# EAGLE design MRCS-Nano-Grade-Xing-Breakout (EAGLE 7.7.0)
PCR Clinic board
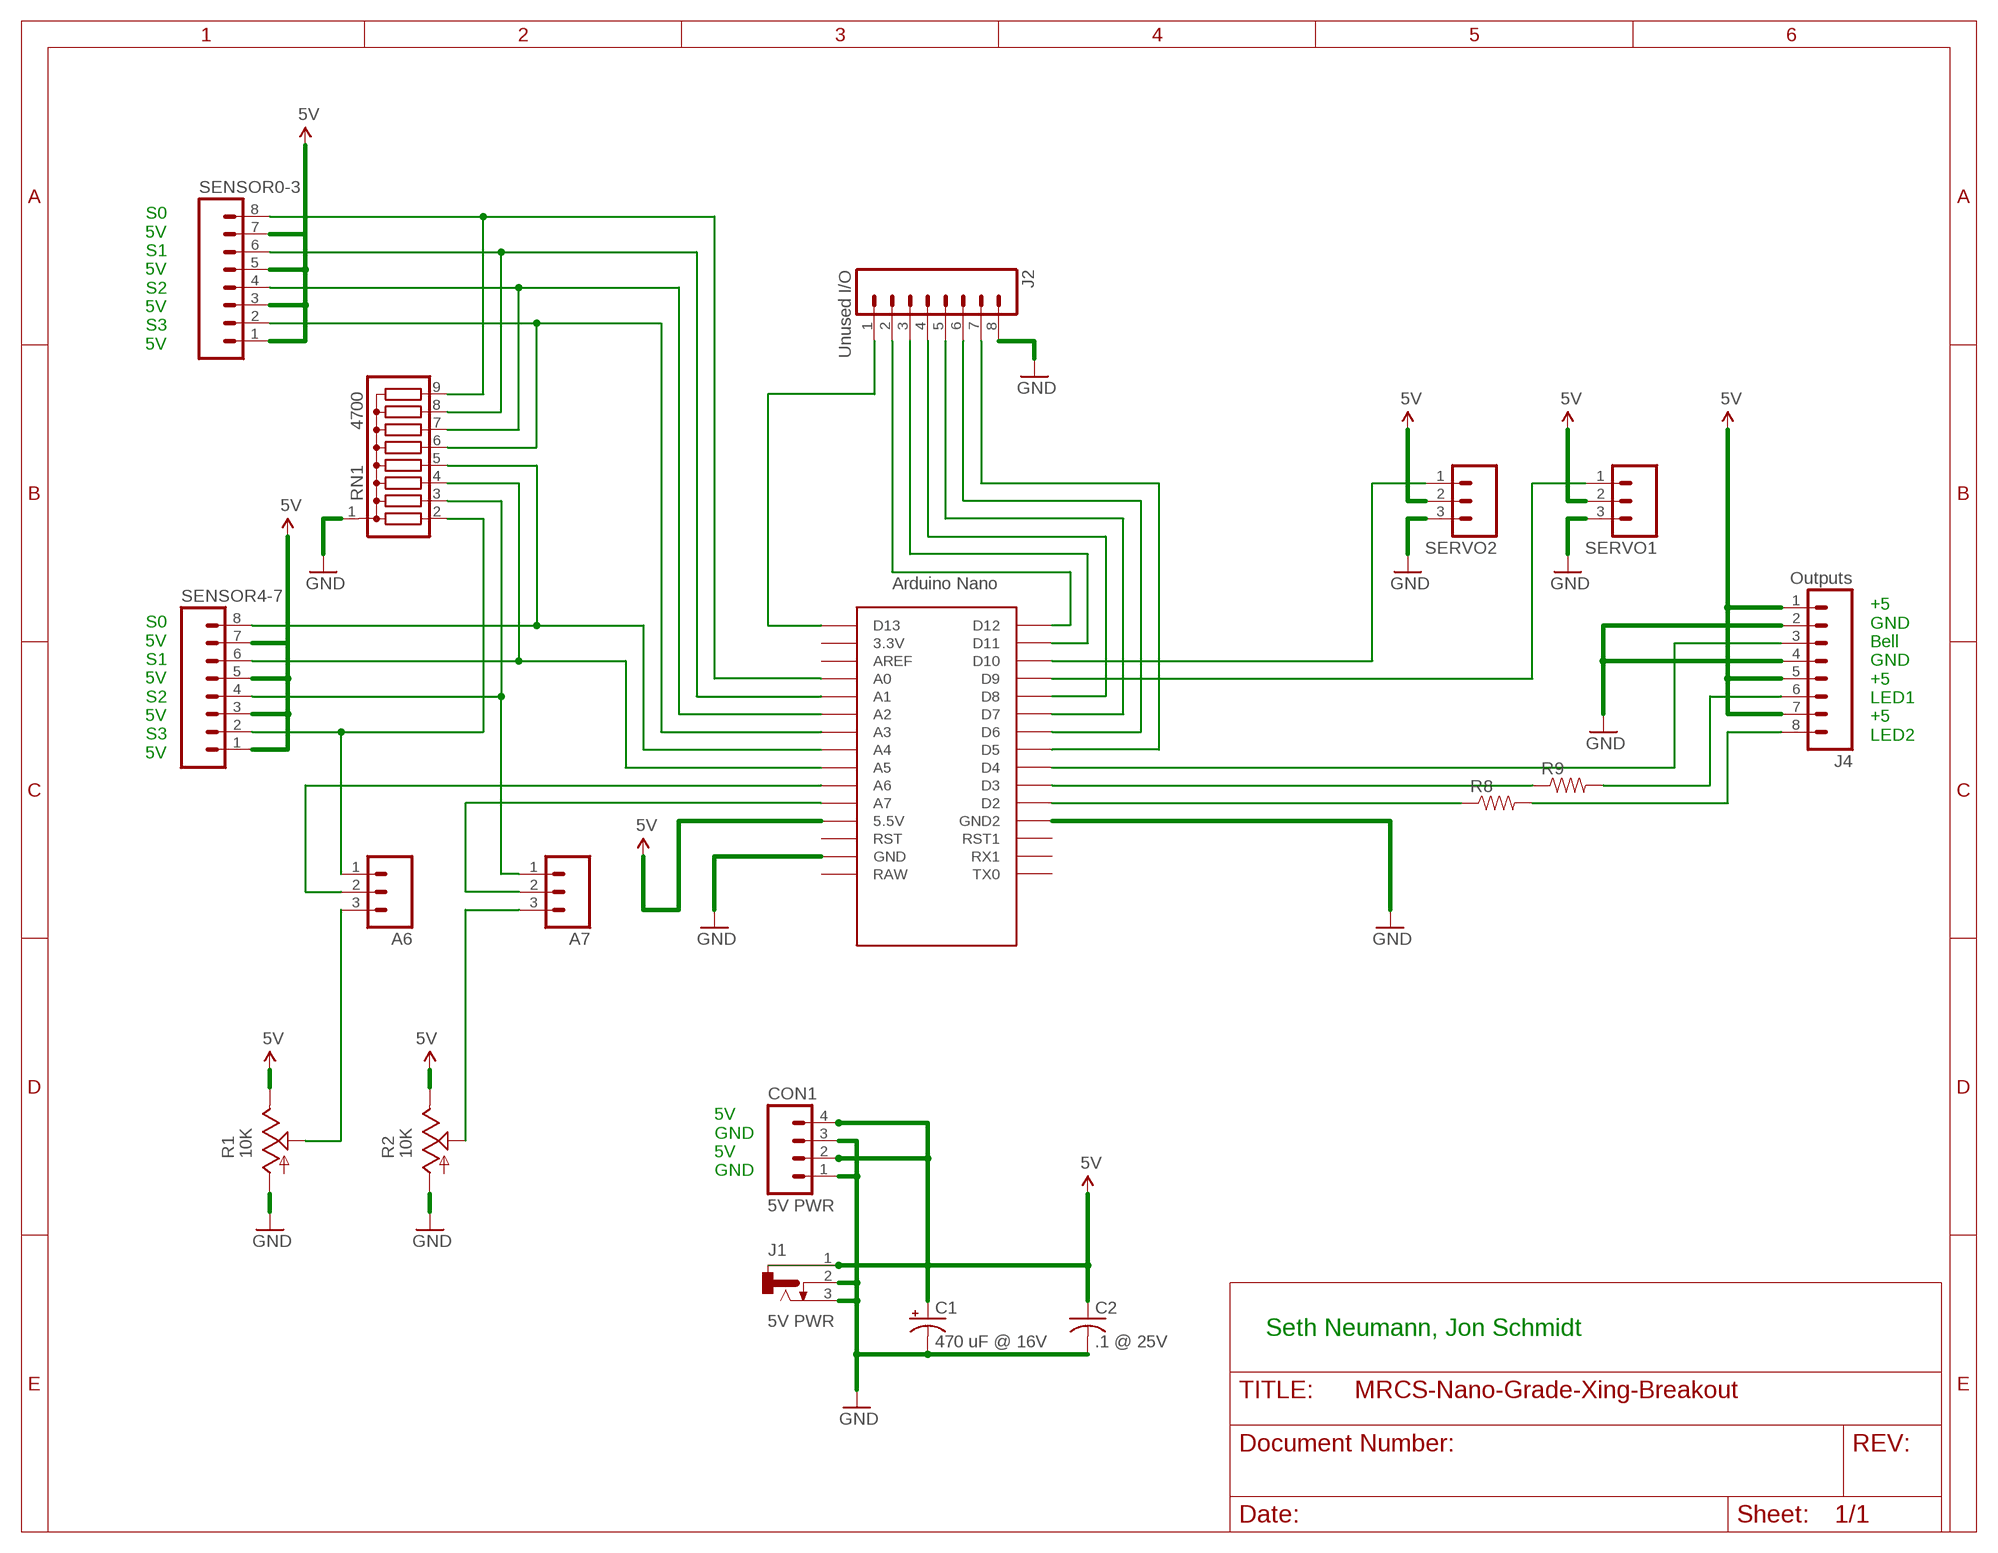
[diagram p0: schematic, sheet 1]

## Parts
A6  M03LOCK  [1X03_LOCK]
A7  M03LOCK  [1X03_LOCK]
C1  470 uF @ 16V  CAP-POLPTH-3.5MM  [E3.5-10]
C2  .1 @ 25V  CAPPTH2  [C-PTH-0.100]
CON1  5V PWR  CONNECTOR-M04SCREW_LOCK  [SCREWTERMINAL-3.5MM-4_LOCK]
J1  5V PWR  CONNECTOR-DC-POWER-RA  [DCJ0202]
J2  Unused I/O  CONNECTOR-M08LOCK  [1X08_LOCK]
J4  Outputs  CONNECTOR-M08LOCK  [1X08_LOCK]
R1  10K  TRIM_US-RS3  [RS3]
R2  10K  TRIM_US-RS3  [RS3]
R8  RPTH-R0  [CUT-R]
R9  RPTH-R0  [CUT-R]
RN1  4700  G08R  [SIL9]
SENSOR0-3  CONNECTOR-M08LOCK  [1X08_LOCK]
SENSOR4-7  CONNECTOR-M08LOCK  [1X08_LOCK]
SERVO1  M03LOCK  [1X03_LOCK]
SERVO2  M03LOCK  [1X03_LOCK]
U$1  NANO  [NANO]

## Nets
5V [Power]: C1.+ C2.1 CON1.2 CON1.4 J1.1 J4.1 J4.5 J4.7 R1.E R2.E SENSOR0-3.1 SENSOR0-3.3 SENSOR0-3.5 SENSOR0-3.7 SENSOR4-7.1 SENSOR4-7.3 SENSOR4-7.5 SENSOR4-7.7 SERVO1.2 SERVO2.2 U$1.5V(5.5V)
A0: RN1.9 SENSOR0-3.8 U$1.A0
GND [Power]: C1.- C2.2 CON1.1 CON1.3 J1.2 J1.3 J2.8 J4.2 J4.4 R1.A R2.A RN1.1 SERVO1.3 SERVO2.3 U$1.GND U$1.GND1(GND2)
N$1: RN1.5 SENSOR4-7.8 U$1.A4
N$2: R8.P2 U$1.D2
N$3: J4.8 R8.P1
N$4: R9.P2 U$1.D3
N$5: J4.6 R9.P1
N$6: J4.3 U$1.D4
N$7: RN1.4 SENSOR4-7.6 U$1.A5
N$8: SERVO2.1 U$1.D10
N$9: SERVO1.1 U$1.D9
N$10: RN1.7 SENSOR0-3.4 U$1.A2
N$11: A7.1 RN1.3 SENSOR4-7.4
N$12: RN1.6 SENSOR0-3.2 U$1.A3
N$13: A6.1 RN1.2 SENSOR4-7.2
N$14: A6.3 R1.S
N$15: A6.2 U$1.A6
N$16: A7.2 U$1.A7
N$17: RN1.8 SENSOR0-3.6 U$1.A1
N$18: A7.3 R2.S
N$19: J2.1 U$1.D13
N$20: J2.2 U$1.D12
N$21: J2.3 U$1.D11
N$22: J2.4 U$1.D8
N$23: J2.5 U$1.D7
N$24: J2.6 U$1.D6
N$25: J2.7 U$1.D5
Unconnected: U$1.3.3V U$1.AREF U$1.RAW U$1.RST U$1.RST1 U$1.RX1 U$1.TX0

## Notes on the sheet
- S0
  5V
  S1
  5V
  S2
  5V
  S3
  5V
- +5
  GND
  Bell
  GND
  +5
  LED1
  +5
  LED2
- S0
  5V
  S1
  5V
  S2
  5V
  S3
  5V
- 5V
  GND
  5V
  GND
- Seth Neumann, Jon Schmidt

## Library data of the parts
A6 A7 SERVO1 SERVO2 = SparkFun-Connectors:M03: Header 3 Standard 3-pin 0.1" header. Use with straight break away headers (SKU : PRT-00116), right angle break away headers (PRT-00553), swiss pins (PRT-00743), machine pins (PRT-00117), and female headers (PRT-00115). Molex polarized connector foot print use with SKU : PRT-08232 with associated crimp pins and housings.
C1 = SPCoast:CAP-POL*
C2 = SPCoast:CAP*
CON1 = SPCoast:CONNECTOR-M04: Header 4 Standard 4-pin 0.1" header. Use with straight break away headers (SKU : PRT-00116), right angle break away headers (PRT-00553), swiss pins (PRT-00743), machine pins (PRT-00117), and female headers (PRT-00115). Molex polarized connector foot print use with SKU : PRT-08231 with associated crimp pins and housings. 1MM SMD Version SKU: PRT-10208
J1 = SPCoast:CONNECTOR-DC-POWER: DC POWER JACK Source: DCJ0202.pdf
J2 J4 SENSOR0-3 SENSOR4-7 = SPCoast:CONNECTOR-M08: Header 8 Standard 8-pin 0.1" header. Use with straight break away headers (SKU : PRT-00116), right angle break away headers (PRT-00553), swiss pins (PRT-00743), machine pins (PRT-00117), and female headers (PRT-00115).
R1 R2 = pot:TRIM_US-: POTENTIOMETER
R8 R9 = SPCoast:R*: Resistor Basic schematic elements and footprints for 0603, 1206, and PTH 1/10th watt (small) resistors.
RN1 = resistor-sil:G08R: SIL RESISTOR; OC_FARNELL: unknown; OC_NEWARK: unknown
U$1 = Arduino-clone-scn:NANO: Arduino Nano

## Net classes
0 default: width 0.305 mm
1 Power: width 0.61 mm

## Board
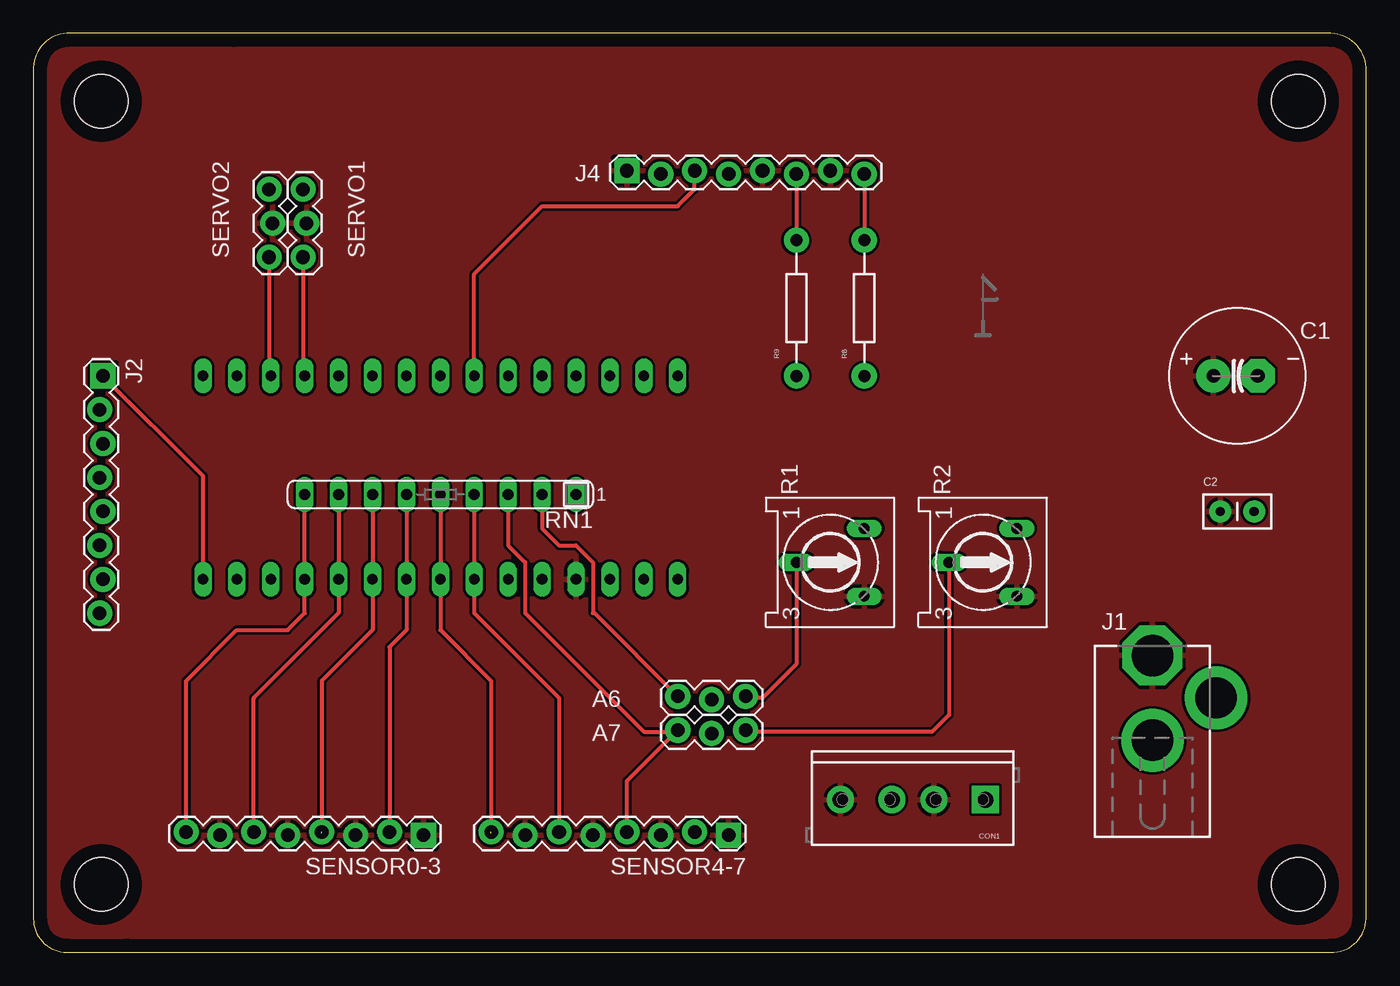
[diagram p1: board, top side]
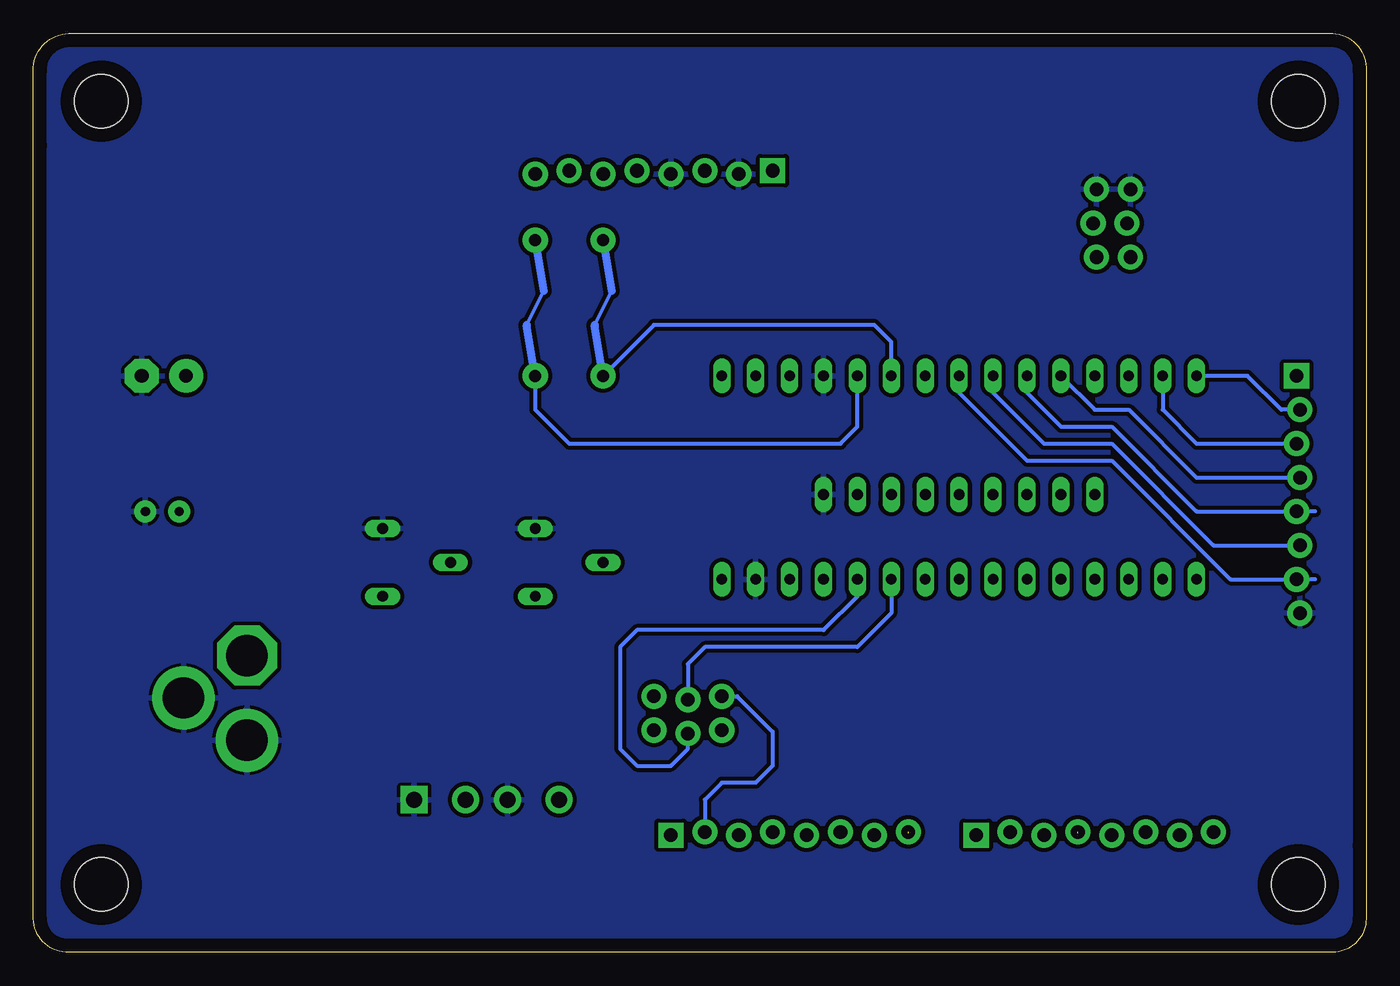
[diagram p2: board, bottom side, seen from below]

Size 99.82 x 68.83 mm. Coordinates in mm from the lower left corner, seen from the top.
Copper layers (1*16): Top 0.035mm / dielectric 1.5mm / Bottom 0.035mm
Design rules "default": minimum track width 10mil, minimum drill 24mil, track to track 8mil, track to pad 8mil, pad to pad 8mil, via to via 8mil, smd to smd 8mil, copper to edge 40mil, drill to drill 8mil, minimum pad ring 10mil, minimum via ring 8mil, stop-mask expansion 4mil, vias tented up to drill 0mil, thermal gap 10mil

### Footprints (pad centres in the part's own frame; a part is rotated, then mirrored left to right if it is on the bottom)
1X03_LOCK = drill 1.016 pad 1.88: 1 0,0.127; 2 2.54,-0.127; 3 5.08,0.127
E3.5-10 = drill 1.016 pad 2.54: + -1.79,0 | drill 1.016 pad 2.54 octagon: - 1.54,0
C-PTH-0.100 = drill 0.7 pad 1.651: 1 -1.27,0; 2 1.27,0
SCREWTERMINAL-3.5MM-4_LOCK = drill 1.2 pad 2.032 square: 1 -0.178,0 | drill 1.2 pad 2.032: 2 3.678,0; 3 6.822,0; 4 10.678,0
DCJ0202 = drill 3.1 pad 4.5 octagon: 1 0,3.175 | drill 3.1 pad 4.7: 2 4.763,0; 3 0,-3.175
1X08_LOCK = drill 1.016 pad 1.88 square: 1 0,0.127 | drill 1.016 pad 1.88: 2 2.54,-0.127; 3 5.08,0.127; 4 7.62,-0.127; 5 10.16,0.127; 6 12.7,-0.127; 7 15.24,0.127; 8 17.78,-0.127
RS3 = drill 0.813 long: A -2.54,2.54; E 2.54,2.54; S 0,-2.54
CUT-R = drill 0.9 pad 1.88: P1 5.08,0; P2 -5.08,0
SIL9 = drill 0.813 long: 1 -10.16,0; 2 -7.62,0; 3 -5.08,0; 4 -2.54,0; 5 0,0; 6 2.54,0; 7 5.08,0; 8 7.62,0; 9 10.16,0
NANO = drill 0.8 long: 3.3V -10.16,24.13; 5V -10.16,-1.27; A0 -10.16,19.05; A1 -10.16,16.51; A2 -10.16,13.97; A3 -10.16,11.43; A4 -10.16,8.89; A5 -10.16,6.35; A6 -10.16,3.81; A7 -10.16,1.27; AREF -10.16,21.59; D2 5.08,1.27; D3 5.08,3.81; D4 5.08,6.35; D5 5.08,8.89; D6 5.08,11.43; D7 5.08,13.97; D8 5.08,16.51; D9 5.08,19.05; D10 5.08,21.59; D11 5.08,24.13; D12 5.08,26.67; D13 -10.16,26.67; GND -10.16,-6.35; GND1 5.08,-1.27; RAW -10.16,-8.89; RST -10.16,-3.81; RST1 5.08,-3.81; RX1 5.08,-6.35; TX0 5.08,-8.89
BOARD-DINRAIL-2.7IN = hole 4: 94.742,5.08; 5.08,63.754; 94.742,63.754; 5.08,5.08

### Placement (x,y rotation side)
A6  48.26,19.05 0 top
A7  48.26,16.51 0 top
C1  90.17,43.18 0 top
C2  90.17,33.02 0 top
CON1  71.12,11.43 180 top
J1  83.82,19.05 0 top
J2  5.08,43.18 270 top
J4  44.45,58.42 0 top
R1  59.69,29.21 270 top
R2  71.12,29.21 270 top
R8  62.23,48.26 90 top
R9  57.15,48.26 90 top
RN1  30.48,34.29 180 top
SENSOR0-3  29.21,8.89 180 top
SENSOR4-7  52.07,8.89 180 top
SERVO1  20.32,52.07 90 top
SERVO2  17.78,52.07 90 top
U$1  39.37,38.1 90 top
U$2  [CA-PROP65WARNING]  46.99,50.8 0 top
U$3  [MRCSLOGOTOP]  69.85,45.72 0 top
U$10  [BOARD-DINRAIL-2.7IN]  0,0 0 top

### Tracks (layer width: path | path; a pad name or v marks a point on that pad's centre or on a via)
5V
  pour Top: 0,68.58 100.33,68.58 100.33,0 0,0
A0
  Top 0.305: SENSOR0-3.8 11.43,20.32 15.24,24.13 19.05,24.13 20.32,25.4 U$1.A0 RN1.9
GND
  pour Bottom (isolate 0.305): 0,68.58 100.33,68.58 100.33,0 0,0
N$1  (1 unrouted)
  Top 0.305: RN1.5 U$1.A4 30.48,24.13 34.29,20.32 34.29,8.89
N$2
  Bottom 0.305: R8.P2 62.23,40.64 59.69,38.1 39.37,38.1 38.1,39.37 U$1.D2
N$3
  Top 0.305: J4.8 R8.P1
N$4
  Bottom 0.305: U$1.D3 35.56,45.72 36.83,46.99 53.34,46.99 R9.P2
N$5
  Top 0.305: J4.6 R9.P1
N$6
  Top 0.305: U$1.D4 33.02,50.8 38.1,55.88 48.26,55.88 49.53,57.15 J4.3
N$7
  Top 0.305: RN1.4 U$1.A5 33.02,25.4 39.37,19.05 SENSOR4-7.6
N$8
  Top 0.305: SERVO2.1 17.66,43.31 U$1.D10
N$9
  Top 0.305: SERVO1.1 20.2,43.31 U$1.D9
N$10  (1 unrouted)
  Top 0.305: RN1.7 U$1.A2 25.4,24.13 21.59,20.32 21.59,8.89
N$11
  Top 0.305: RN1.3 35.56,30.48 36.83,29.21 36.83,25.4 45.72,16.51 48.14,16.51 A7.1 44.45,12.83 SENSOR4-7.4
N$12
  Top 0.305: RN1.6 U$1.A3 27.94,24.13 26.67,22.86 SENSOR0-3.2
N$13
  Top 0.305: RN1.2 38.1,31.75 39.37,30.48 40.64,30.48 41.91,29.21 41.91,25.4 42.04,25.4 A6.1
  Bottom 0.305: A6.1 47.12,19.18 44.45,16.51 44.45,13.97 45.72,12.7 48.26,12.7 49.53,11.43 SENSOR4-7.2
N$14
  Top 0.305: R1.S 57.15,21.59 54.61,19.05 53.47,19.05 A6.3
N$15
  Bottom 0.305: U$1.A6 35.56,25.4 38.1,22.86 49.53,22.86 50.8,21.59 A6.2
N$16
  Bottom 0.305: U$1.A7 38.1,26.67 40.64,24.13 54.61,24.13 55.88,22.86 55.88,15.24 54.61,13.97 52.07,13.97 50.8,15.24 A7.2
N$17
  Top 0.305: RN1.8 U$1.A1 22.86,25.4 16.51,19.05 SENSOR0-3.6 16.51,8.89
N$18
  Top 0.305: R2.S 68.58,17.78 67.31,16.51 53.47,16.51 A7.3
N$19
  Top 0.305: U$1.D13 12.7,35.69 J2.1
N$20
  Bottom 0.305: J2.2 6.35,40.64 8.89,43.18 U$1.D12
N$21
  Bottom 0.305: U$1.D11 15.24,40.64 12.7,38.1 J2.3 5.08,38.1
N$22
  Bottom 0.305: U$1.D8 20.32,40.64 17.78,40.64 12.7,35.56 J2.4
N$23
  Bottom 0.305: U$1.D7 25.4,41.91 22.86,39.37 19.05,39.37 12.7,33.02 J2.5 3.81,33.02
N$24
  Bottom 0.305: U$1.D6 27.94,41.91 24.13,38.1 19.05,38.1 11.43,30.48 J2.6
N$25
  Bottom 0.305: U$1.D5 30.48,41.91 25.4,36.83 19.05,36.83 10.16,27.94 J2.7 3.81,27.94

### Text on the board
tDocu: Seth Neumann / Jon Schmidt | Grade Xing Breakout | +GBG+L+L / 5NLN5152 | V1.0 20220314 | BROWN | ORANGE | USB | Arduino Nano | 5G5G | 5VDC | 05152535 | 45556575
bDocu: 0+1+2+3+ | 4+5+6+7+